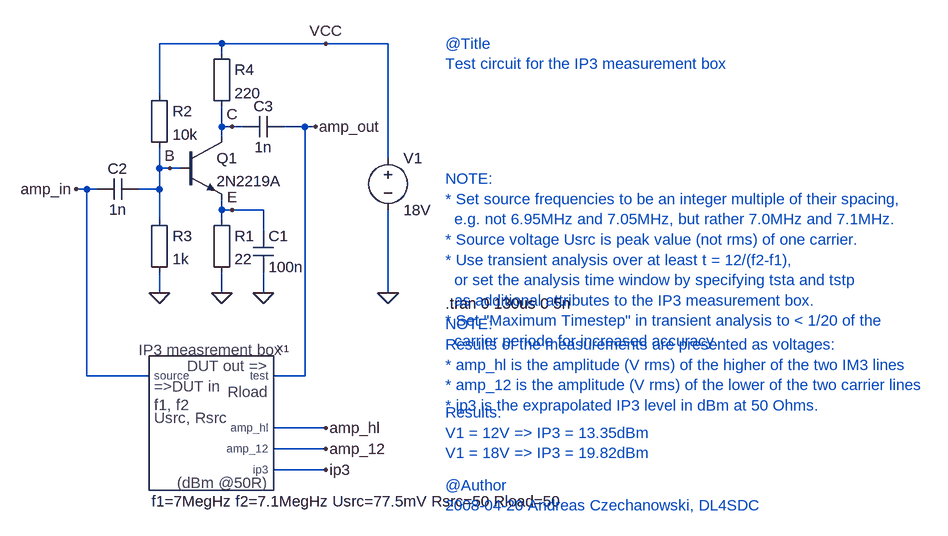
[diagram p0: schematic IP3-test-3.asc]
IP3-test-3.asc, the LTspice schematic file:
Version 4
SHEET 1 1164 768
WIRE 224 -16 128 -16
WIRE 384 -16 224 -16
WIRE 480 -16 384 -16
WIRE 224 0 224 -16
WIRE 128 64 128 -16
WIRE 224 112 224 80
WIRE 240 112 224 112
WIRE 256 112 240 112
WIRE 352 112 320 112
WIRE 368 112 352 112
WIRE 224 128 224 112
WIRE 480 160 480 -16
WIRE 128 176 128 144
WIRE 144 176 128 176
WIRE 160 176 144 176
WIRE 16 208 0 208
WIRE 32 208 16 208
WIRE 128 208 128 176
WIRE 128 208 96 208
WIRE 224 240 224 224
WIRE 240 240 224 240
WIRE 288 240 240 240
WIRE 128 256 128 208
WIRE 224 256 224 240
WIRE 288 272 288 240
WIRE 128 368 128 336
WIRE 224 368 224 336
WIRE 288 368 288 336
WIRE 480 368 480 240
WIRE 16 496 16 208
WIRE 112 496 16 496
WIRE 352 496 352 112
WIRE 352 496 304 496
WIRE 384 576 304 576
WIRE 384 608 304 608
WIRE 384 640 304 640
FLAG 128 368 0
FLAG 224 368 0
FLAG 288 368 0
FLAG 0 208 amp_in
FLAG 368 112 amp_out
FLAG 480 368 0
FLAG 144 176 B
FLAG 240 240 E
FLAG 240 112 C
FLAG 384 -16 VCC
FLAG 384 576 amp_hl
FLAG 384 608 amp_12
FLAG 384 640 ip3
SYMBOL npn 160 128 R0
SYMATTR InstName Q1
SYMATTR Value 2N2219A
SYMBOL Misc\\EuropeanResistor 208 240 R0
SYMATTR InstName R1
SYMATTR Value 22
SYMBOL Misc\\EuropeanResistor 112 48 R0
SYMATTR InstName R2
SYMATTR Value 10k
SYMBOL Misc\\EuropeanResistor 112 240 R0
SYMATTR InstName R3
SYMATTR Value 1k
SYMBOL cap 272 272 R0
SYMATTR InstName C1
SYMATTR Value 100n
SYMBOL Misc\\EuropeanResistor 208 -16 R0
SYMATTR InstName R4
SYMATTR Value 220
SYMBOL cap 32 224 R270
WINDOW 0 32 32 VTop 0
WINDOW 3 0 32 VBottom 0
SYMATTR InstName C2
SYMATTR Value 1n
SYMBOL cap 256 128 R270
WINDOW 0 32 32 VTop 0
WINDOW 3 0 32 VBottom 0
SYMATTR InstName C3
SYMATTR Value 1n
SYMBOL voltage 480 144 R0
SYMATTR InstName V1
SYMATTR Value 18V
SYMBOL IP3_adapter-3 208 560 R0
WINDOW 39 -92 129 Left 0
SYMATTR Description IP3 measurement generator / analyzer ; Set source frequencies f1 and f2, source level Usrc, source resistance Rsrc and input resistance Rload. Set source frequencies to be an integer multiple of the spacing. Use transient analysis over at least t = 21/(f2-
SYMATTR InstName X1
SYMATTR SpiceLine f1=7MegHz f2=7.1MegHz Usrc=77.5mV Rsrc=50 Rload=50
TEXT 568 384 Left 0 !.tran 0 130us 0 5n
TEXT 568 192 Left 0 ;NOTE:\n* Set source frequencies to be an integer multiple of their spacing,\n  e.g. not 6.95MHz and 7.05MHz, but rather 7.0MHz and 7.1MHz.\n* Source voltage Usrc is peak value (not rms) of one carrier.\n* Use transient analysis over at least t = 12/(f2-f1),\n  or set the analysis time window by specifying tsta and tstp\n  as additional attributes to the IP3 measurement box.\n* Set "Maximum Timestep" in transient analysis to < 1/20 of the\n  carrier periode for increased accuracy.
TEXT 568 664 Left 0 ;@Author\n2008-04-20 Andreas Czechanowski, DL4SDC
TEXT 568 -16 Left 0 ;@Title\nTest circuit for the IP3 measurement box
TEXT 568 416 Left 0 ;NOTE:\nResults of the measurements are presented as voltages:\n* amp_hl is the amplitude (V rms) of the higher of the two IM3 lines\n* amp_12 is the amplitude (V rms) of the lower of the two carrier lines\n* ip3 is the exprapolated IP3 level in dBm at 50 Ohms.
TEXT 568 552 Left 0 ;Results:\nV1 = 12V => IP3 = 13.35dBm\nV1 = 18V => IP3 = 19.82dBm

The netlist it stands for:
* IP3-test-3.asc
Q1 C B E 0 2N2219A
R1 E 0 22
R2 VCC B 10k
R3 B 0 1k
C1 E 0 100n
R4 VCC C 220
C2 amp_in B 1n
C3 C amp_out 1n
V1 VCC 0 18V
XX1 amp_in amp_out amp_hl amp_12 ip3 IP3_adapter-3 params: f1=7MegHz f2=7.1MegHz Usrc=77.5mV Rsrc=50 Rload=50  ; pins source test amp_hl amp_12 ip3
.model NPN NPN
.model PNP PNP
.lib standard.bjt
.tran 0 130us 0 5n
* NOTE:
* * Set source frequencies to be an integer multiple of their spacing,
*   e.g. not 6.95MHz and 7.05MHz, but rather 7.0MHz and 7.1MHz.
* * Source voltage Usrc is peak value (not rms) of one carrier.
* * Use transient analysis over at least t = 12/(f2-f1),
*   or set the analysis time window by specifying tsta and tstp
*   as additional attributes to the IP3 measurement box.
* * Set "Maximum Timestep" in transient analysis to < 1/20 of the
*   carrier periode for increased accuracy.
* @Author
* 2008-04-20 Andreas Czechanowski, DL4SDC
* @Title
* Test circuit for the IP3 measurement box
* NOTE:
* Results of the measurements are presented as voltages:
* * amp_hl is the amplitude (V rms) of the higher of the two IM3 lines
* * amp_12 is the amplitude (V rms) of the lower of the two carrier lines
* * ip3 is the exprapolated IP3 level in dBm at 50 Ohms.
* Results:
* V1 = 12V => IP3 = 13.35dBm
* V1 = 18V => IP3 = 19.82dBm
.backanno
.end